# Altium schematic sheet CustomESP32V2.SchDoc
size A; SheetNumber: 2; SheetTotal: 2
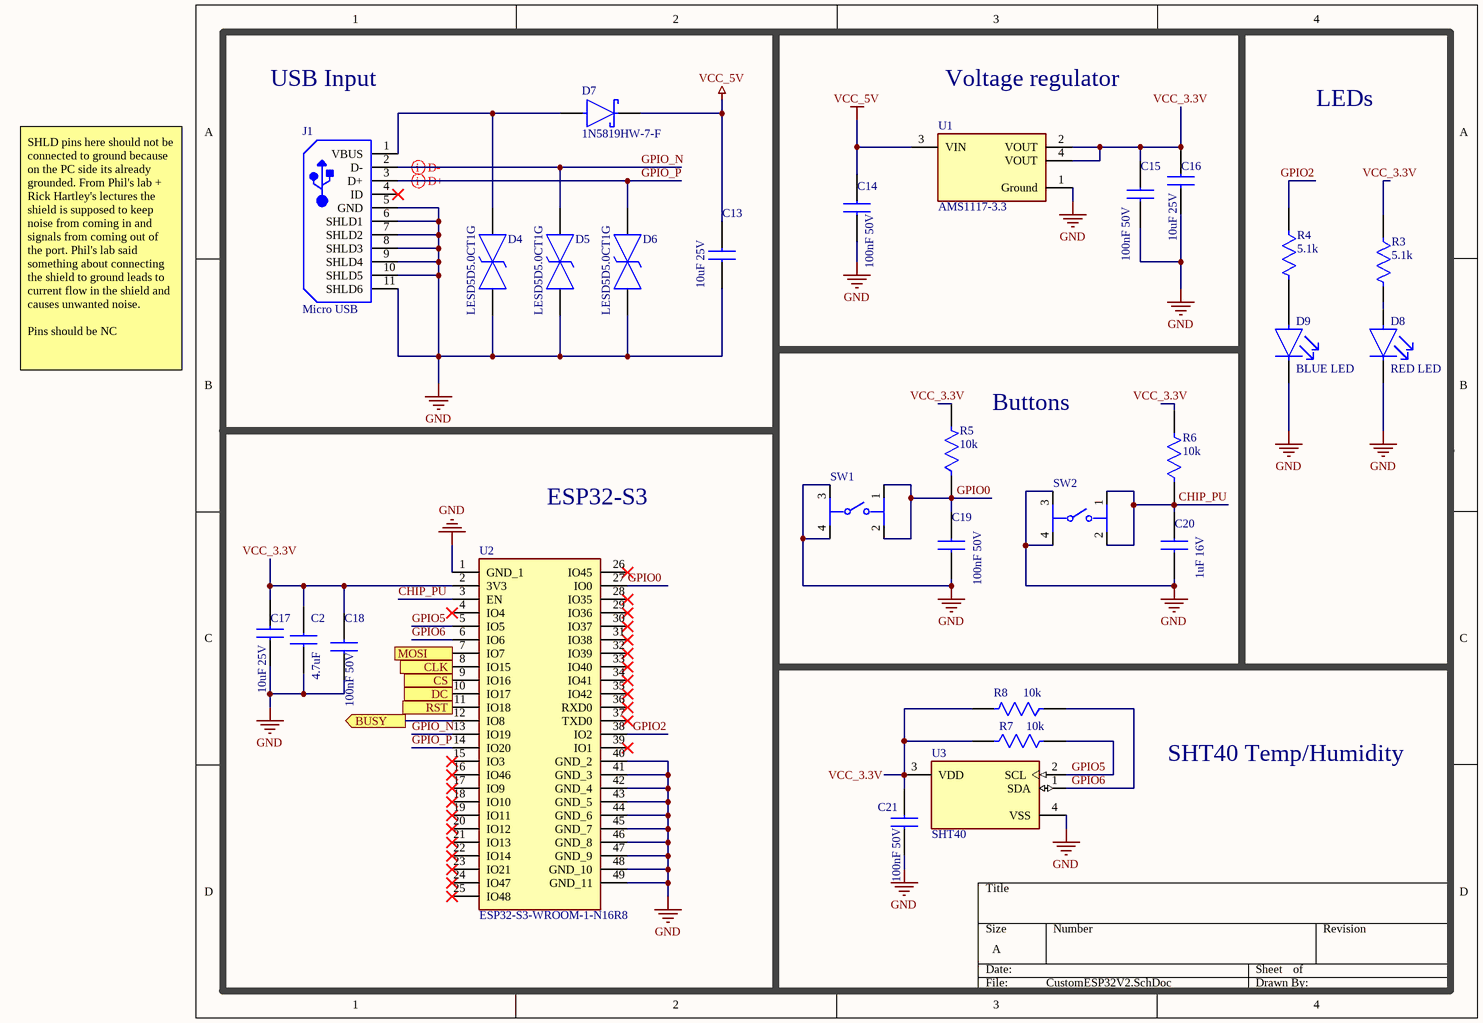
[diagram p0: CustomESP32V2.SchDoc]

## Parts
C2  4.7uF  [CAPC1608X90N]
C13  10uF 25V  [CAPC2012X145N]
C14  100nF 50V  [CAPC1608X90N]
C15  100nF 50V  [CAPC1608X90N]
C16  10uF 25V  [CAPC2012X145N]
C17  10uF 25V  [CAPC2012X145N]
C18  100nF 50V  [CAPC1608X90N]
C19  100nF 50V  [CAPC1608X90N]
C20  1uF 16V  [CAPC1608X90N]
C21  100nF 50V  [CAPC1608X90N]
D4  LESD5D5.0CT1G  [LESD5D50CT1G]
D5  LESD5D5.0CT1G  [LESD5D50CT1G]
D6  LESD5D5.0CT1G  [LESD5D50CT1G]
D7  1N5819HW-7-F  [FP-SOD123-IPC_A]
D8  RED LED  [FP-6_541-5092_01-4-MFG]
D9  BLUE LED  [FP-6_541-5094_01-4-MFG]
J1  Micro USB  [USB-MICRO-B_V]
R3  5.1k  [FP-CRCW0603-e3-MFG]
R4  5.1k  [FP-CRCW0603-e3-MFG]
R5  10k  [FP-RC1608-MFG]
R6  10k  [FP-RC1608-MFG]
R7  10k  [FP-RC1608-MFG]
R8  10k  [FP-RC1608-MFG]
SW1  PTS810SJM250SMTRLFS  [FP-PTS810SJM250SMTRLFS-MFG]  (value not drawn)
SW2  PTS810SJM250SMTRLFS  [FP-PTS810SJM250SMTRLFS-MFG]  (value not drawn)
U1  AMS1117-3.3  [FP-AMS1117-IPC_C]
U2  ESP32-S3-WROOM-1-N16R8  [ESP32S3WROOM1N16R8]
U3  SHT40  [FP-SHT40-AD1B-R2-MFG]

## Blocks framed on the sheet
USB Input: C13 D4-D7 J1
Voltage regulator: C14-C16 U1
LEDs: D8 D9 R3 R4
Buttons: C19 C20 R5 R6 SW1 SW2
ESP32-S3: C2 C17 C18 U2

## Ports
BUSY (out, see DriverForDisplay[2B]), CLK (out, see DriverForDisplay[2B]), CS (out, see DriverForDisplay[2B]), DC (out, see DriverForDisplay[2B]), MOSI (out, see DriverForDisplay[2B]), RST (out, see DriverForDisplay[2B])

## Nets
GND: C2.1 C13.2 C14.2 C15.2 C16.2 C17.2 C18.2 C19.2 C20.1 C21.1 D4.1 D5.1 D6.1 D8.1(C) D9.1(C) J1.5(GND) J1.6(SHLD1) J1.7(SHLD2) J1.8(SHLD3) J1.9(SHLD4) J1.10(SHLD5) J1.11(SHLD6) SW1.3 SW1.4 SW2.3 SW2.4 U1.1(Ground) U2.1(GND_1) U2.40(GND_2) U2.41(GND_3) U2.42(GND_4) U2.43(GND_5) U2.44(GND_6) U2.45(GND_7) U2.46(GND_8) U2.47(GND_9) U2.48(GND_10) U2.49(GND_11) U3.4(VSS)
VCC_5V: C13.1 C14.1 D7.1(C) U1.3(VIN)
BUSY: U2.12(IO8) ; port BUSY
CHIP_PU: C20.2 R6.1 SW2.1 SW2.2 U2.3(EN)
CLK: U2.8(IO15) ; port CLK
CS: U2.9(IO16) ; port CS
DC: U2.10(IO17) ; port DC
GPIO0: C19.1 R5.1 SW1.1 SW1.2 U2.27(IO0)
GPIO2: R4.1 U2.38(IO2)
GPIO5: R7.2 U2.5(IO5) U3.2(SCL)
GPIO6: R8.1 U2.6(IO6) U3.1(SDA)
GPIO_N: D5.2 J1.2(D-) U2.13(IO19)
GPIO_P: D6.2 J1.3(D+) U2.14(IO20)
MOSI: U2.7(IO7) ; port MOSI
RST: U2.11(IO18) ; port RST
VCC_3.3V: C2.2 C15.1 C16.1 C17.1 C18.1 C21.2 R3.1 R5.2 R6.2 R7.1 R8.2 U1.2(VOUT) U1.4(VOUT) U2.2(3V3) U3.3(VDD)
NetD4_2: D4.2 D7.2(A) J1.1(VBUS)
NetD8_2: D8.2(A) R3.2
NetD9_2: D9.2(A) R4.2

Not connected (* = marked no-connect by the designer): J1 4(ID)*; U2 4(IO4)* 15(IO3)* 16(IO46)* 17(IO9)* 18(IO10)* 19(IO11)* 20(IO12)* 21(IO13)* 22(IO14)* 23(IO21)* 24(IO47)* 25(IO48)* 26(IO45)* 28(IO35)* 29(IO36)* 30(IO37)* 31(IO38)* 32(IO39)* 33(IO40)* 34(IO41)* 35(IO42)* 36(RXD0)* 37(TXD0)* 39(IO1)*

## Layout directives
differential pair: GPIO_N, GPIO_P

## Notes on the sheet
- SHLD pins here should not be connected to ground because on the PC side its already grounded. From Phil's lab + Rick Hartley's lectures the shield is supposed to keep noise from coming in and signals from coming out of the port. Phil's lab said something about connecting the shield to ground leads to current flow in the shield and causes unwanted noise.
  Pins should be NC
- SHT40 Temp/Humidity

## Library data of the parts
C2 = CL10A475KO8NNNC: Capacitor; Manufacturer_Name: SAMSUNG; Datasheet Link: https://rs.componentsearchengine.com/Datasheets/2/CL10A475KO8NNNC.pdf; Height: 0.9mm; Manufacturer_Part_Number: CL10A475KO8NNNC; Mouser Part Number: 187-CL10A475KO8NNNC; Mouser Price/Stock: https://www.mouser.co.uk/ProductDetail/Samsung-Electro-Mechanics/CL10A475KO8NNNC?qs=X6jEic%2FHinAbIjmLnFfqqQ%3D%3D; Arrow Part Number: CL10A475KO8NNNC; Arrow Price/Stock: https://www.arrow.com/en/products/cl10a475ko8nnnc/samsung-electro-mechanics?utm_currency=USD&region=europe
C13 C16 C17 = CL21A106KAYNNNG: Cap Ceramic 10uF 25V X5R 10% SMD 0805 85C Embossed T/R; Manufacturer_Name: SAMSUNG; Datasheet Link: https://www.arrow.com/en/products/cl21a106kaynnng/samsung-electro-mechanics; Height: 1.45mm; Manufacturer_Part_Number: CL21A106KAYNNNG; Mouser Part Number: 187-CL21A106KAYNNNG; Mouser Price/Stock: https://www.mouser.co.uk/ProductDetail/Samsung-Electro-Mechanics/CL21A106KAYNNNG?qs=yOVawPpwOwl2HL%252Buj2PlNg%3D%3D; Arrow Part Number: CL21A106KAYNNNG; Arrow Price/Stock: https://www.arrow.com/en/products/cl21a106kaynnng/samsung-electro-mechanics?region=nac
C14 C15 C18 C19 C21 = GRM188R71H104KA93D: Ceramic SMT capacitor 100nF 50Vdc Murata 0603 GRM 100nF Ceramic Multilayer Capacitor, 50 V dc, +125?C, X7R Dielectric, ?10%; Manufacturer_Name: Murata Electronics; Height: 0.9mm; Datasheet Link: https://datasheet.datasheetarchive.com/originals/distributors/Datasheets_SAMA/ec4f1577dddcc7a13ddad897a28002d3.pdf; Manufacturer_Part_Number: GRM188R71H104KA93D; Mouser Part Number: 81-GRM39X104K50D; Mouser Price/Stock: https://www.mouser.co.uk/ProductDetail/Murata-Electronics/GRM188R71H104KA93D?qs=f7ZljCwbPOm85Y6l%2FNGt7A%3D%3D; Arrow Part Number: GRM188R71H104KA93D; Arrow Price/Stock: https://www.arrow.com/en/products/grm188r71h104ka93d/murata-manufacturing?region=europe
C20 = CL10A105KO8NNNC: Samsung Electro-Mechanics 0603 CL 1μF Ceramic Multilayer Capacitor, 16 V, +85°C, X5R Dielectric, ±10% SMD; Height: 0.9mm; Datasheet Link: https://labcenter.componentsearchengine.com/Datasheets/2/CL10A105KO8NNNC.pdf; Manufacturer_Name: SAMSUNG; Manufacturer_Part_Number: CL10A105KO8NNNC; Mouser Part Number: 187-CL10A105KO8NNNC; Mouser Price/Stock: https://www.mouser.co.uk/ProductDetail/Samsung-Electro-Mechanics/CL10A105KO8NNNC?qs=hqM3L16%252BxlfR4qamq4FMLg%3D%3D; Arrow Part Number: CL10A105KO8NNNC; Arrow Price/Stock: https://www.arrow.com/en/products/cl10a105ko8nnnc/samsung-electro-mechanics?region=nac
D4-D6 = LESD5D5.0CT1G: TVS Diode (Bi-directional); Manufacturer_Name: LRC; Height: 0.7mm; Manufacturer_Part_Number: LESD5D5.0CT1G
D7 = CMP-0303-00003-3: DIODE SCHOTTKY 40V 1A SOD123; Forward Voltage: 450mV; Capacitance: 110pF; Max Forward Surge Current (Ifsm): 25A; Peak Reverse Current: 50uA; Polarity: Standard; Element Configuration: Single; Max Power Dissipation: 450mW; Min Operating Temperature: -65°C; Package Quantity: 3000; Contact Plating: Tin; Weight: 0.000353oz; Max Repetitive Reverse Voltage (Vrrm): 40V; Max Reverse Voltage (DC): 40V; Height: 1.25mm; Average Rectified Current: 1A; Width: 1.7mm; Case/Package: SOD-123-2; Lead Free: Lead Free; Max Operating Temperature: 125°C; Current Rating: 1A; Termination: SMD/SMT; Forward Current: 1A; Radiation Hardening: No; Number of Pins: 2; Length: 2.85mm; Voltage Rating (DC): 40V; REACH SVHC: No SVHC; Peak Non-Repetitive Surge Current: 25A; Packaging: Tape and Reel; Output Current: 1A
D8 = CMP-02520-000012-1: LED RED 0603 SMD; Manufacturer: Vishay; Manufacturer Part Number: VLMS1300-GS08; Forward Voltage: 2V; Reverse Voltage: 5V; Power Dissipation: 75mW; Forward Current: 20mA; Luminous Intensity: 54mcd; Led Orientation: Top View; Peak Emmision Wavelength: 639nm; Viewing Angle: 130°; Wavelength: 631nm; Digikey Description: LED RED 0603 SMD; Height: 1mm; Colour: Red; Ambient Temperature Range High: +85°C; Ambient Temperature Range Low: -35°C; Package: 6.541-5092.01-4; Automotive: No; Temperature Range High: +85°C; Device Class L3: unset; Lead Free: Yes; Temperature Range Low: -35°C; Temperature: -35°C to +85°C; Device Class L2: LEDs; ComponentLink2Description: Datasheet; Octopart: https://octopart.com/vlms1300-gs08-vishay-21709201; Device Class L1: Optoelectronics; RoHS: TRUE; ComponentLink2URL: http://www.vishay.com/docs/82437/vlmo1300.pdf; Mouser Description: Standard LEDs - SMD Super Red Clear Non-Diff; Category: Diode
D9 = CMP-02520-000013-1: LED BLUE 0603 SMD; Manufacturer Part Number: VLMB1300-GS08; Manufacturer: Vishay Semiconductor Opto Division; Forward Current: 20mA; Wavelength: 475nm; Viewing Angle: 130°; Forward Voltage: 3.8V; Power Dissipation: 76mW; Luminous Intensity: 28-180mcd; Led Orientation: Top View; Peak Emmision Wavelength: 468nm; RoHS: TRUE; ComponentLink2URL: http://www.vishay.com/docs/82437/vlmo1300.pdf; Ambient Temperature Range Low: -20°C; ComponentLink2Description: Datasheet; Mouser Description: LED; SMD; 0603; blue; 28-180mcd; 1.6x0.8x0.8mm; 130°; 2.8÷3.8V; 20mA; Package: 6.541-5094.01-4; Device Class L3: unset; Automotive: No; Temperature: -20°C to +80°C; Colour: Blue; Digikey Description: LED BLUE 0603 SMD; Device Class L2: LEDs; Temperature Range Low: -20°C; Lead Free: Yes; Category: Diode; Device Class L1: Optoelectronics; Height: 1mm; Octopart: https://octopart.com/vlmb1300-gs08-vishay-22022408; Temperature Range High: +80°C; Ambient Temperature Range High: +80°C
J1 = CMP-2000-05827-1: Micro-USB B Receptacle, Right Angle, Bottom Mount, Surface Mount, with Solder Tabs, -30 to 85 degC, 5-Pin USB, RoHS, Tape and Reel; Manufacturer: Molex; Featured Product: Micro-USBConnectorsUSBConnectors; Other Names: WM1399DKR; Package Version: Rev. F, 12/2012; Number of Contacts: 5; Connector Type: USB-microB; Catalog Drawings: 1050170001; 3D Model: 105017-0001.stp; Mating Products: WM17145-ND-CABLEMICROUSBBTOSTDA1.0MWM17147-ND-CABLEMICROUSBBTOSTDA2.0MWM17146-ND-CABLEMICROUSBBTOSTDA1.5M; PCN Assembly/Origin: ResinSupplier21/Oct/2015; Voltage - Max: 30V; Online Catalog: Molex-MicroUSB; Manufacturer URL: http://www.molex.com/; Package Description: 5-Leads USB, Micro B, Body 7.5 x 5 mm, Pitch 0.65 mm; Datasheet URL: http://www.molex.com/elqNow/elqRedir.htm?ref=http://www.molex.com/webdocs/datasheets/pdf/en-us/1050170001_IO_CONNECTORS.pdf; Ingress Protection: -; Datasheet Version: 03/2016; Mounting Type: BoardCutout,SurfaceMount,RightAngle; Circuits: 5; Standard Package: 1; Package Reference: MICRO-B; Package URL: http://www.molex.com/pdm_docs/sd/1050170001_sd.pdf; Category: Connectors,Interconnects; Series: -; RoHS Information: 1050170001CertofCompliance; Features: Shielded,SolderRetention; Family: USB,DVI,HDMIConnectors; Specifications: -; Gender: Receptacle; Packaging: Digi-Reel®; Mounting Technology: SurfaceMount
R3 R4 = CMP-1012-00590-3: RES Thick Film, 5.1kΩ, 1%, 0.1W, 100ppm/°C, 0603; Power Rating: 100mW; Voltage Rating (DC): 75V; Resistance: 5.1kR; Width: 0.85mm; Depth: 0.85mm; Military Standard: Not; Package Quantity: 5000; Case Code (Metric): 1608; Length: 1.55mm; Weight: 7.1E-05oz; Packaging: Tape and Reel; Temperature Coefficient: 100ppm/°C; Case Code (Imperial): 0603; Lead Free: Lead Free; Radiation Hardening: No; Contact Plating: Tin; Composition: Thick Film; Max Operating Temperature: 155°C; Termination: SMD/SMT; Case/Package: 0603; Min Operating Temperature: -55°C; Tolerance: 1%; Voltage Rating: 75V; Mount: Surface Mount; Height: 0.45mm
R5-R8 = CMP-13261-001097-1: Res Thick Film 0603 10kΩ 1% 0.1W ±100ppm/°C Molded SMD T/R; Power Rating: 100mW; Resistance: 10kR; Max Operating Temperature: 155°C; Radiation Hardening: No; Tolerance: 1%; Case/Package: 0603; Case Code (Metric): 1608; Composition: Thick Film; Max Power Dissipation: 100mW; Number of Terminations: 2; Temperature Coefficient: 100ppm/°C; Contact Plating: Tin; Packaging: Tape and Reel; Features: Moisture Resistant; Case Code (Imperial): 0603; Width: 0.031inch; Length: 0.063inch; Military Standard: Not; Depth: 0.8mm; Height: 0.022inch; Min Operating Temperature: -55°C
SW1 SW2 = CMP-10040-000001-2: SWITCH TACTILE SPST-NO 0.05A 16V; Throw Configuration: SPST; Operating Force: 160gf; Actuator Type: Standard; Switch Travel: 0.15mm; Switch Function: Off-Mom; Max Current Rating: 50mA; Mechanical Life: 150000Cycles; Illumination Type: Non-Illuminated; Package Quantity: 2900; Depth: 4.6mm; Mount: Surface Mount; Packaging: Tape and Reel; Length: 3.2mm; RoHS Compliant: Yes; Case/Package: SMD/SMT; Voltage Rating (DC): 16V; Min Operating Temperature: -40°C; Termination: J-Bend; Lead Free: Lead Free; Contact Plating: Silver; Orientation: Straight; Max Operating Temperature: 85°C; Current Rating: 50mA; Color: Black
U1 = CMP-209535-000001-1: LDO Voltage Regulators 1A, 3.3V; Manufacturer: Advanced Monolithic Systems; Dropout Voltage: 1.1V; Output Type: Fixed; Nominal Supply Current: 5mA; Max Power Dissipation: 1.2W; Max Supply Voltage: 15V; Number Of Outputs: 1; Standoff Height: 0.64mm; Max Junction Temp: +125°C; Height: 1.8mm; Package: AMS1117; Device Class L2: Power Management ICs; ComponentLink2Description: Datasheet; ComponentLink2URL: http://www.advanced-monolithic.com/pdf/ds1117.pdf; Category: IC; RoHS: TRUE; Automotive: No; Device Class L1: Integrated Circuits (ICs); Output Current: 1A; Device Class L3: Voltage Regulators - Linear; Temperature: -40°C to +125°C; Output Voltage: 3.3V; Manufacturer Part Number: AMS1117-3.3; Temperature Range Low: -40°C; Octopart: https://octopart.com/ams1117-3.3-advanced+monolithic+systems-25899300; Lead Free: Yes; Ipc Land Pattern Name: SOT229P700X180-4; Temperature Range High: +125°C
U2 = ESP32-S3-WROOM-1-N16R8: Integrated Circuit; Manufacturer_Name: Espressif Systems; Datasheet Link: https://www.espressif.com/sites/default/files/documentation/esp32-s3-wroom-1_wroom-1u_datasheet_en.pdf; Height: 3.25mm; Manufacturer_Part_Number: ESP32-S3-WROOM-1-N16R8; Mouser Part Number: 356-ESP32S3WRM1N16R8; Mouser Price/Stock: https://www.mouser.co.uk/ProductDetail/Espressif-Systems/ESP32-S3-WROOM-1-N16R8?qs=Li%252BoUPsLEnvQc9gW6AMhZg%3D%3D
U3 = CMP-144040-000008-1: SENSOR HUMIDITY 100 RH SMD